# Altium schematic sheet rad_detector_v500_PERIPHERAL.SchDoc
size A4; SheetNumber: 6; SheetTotal: 7
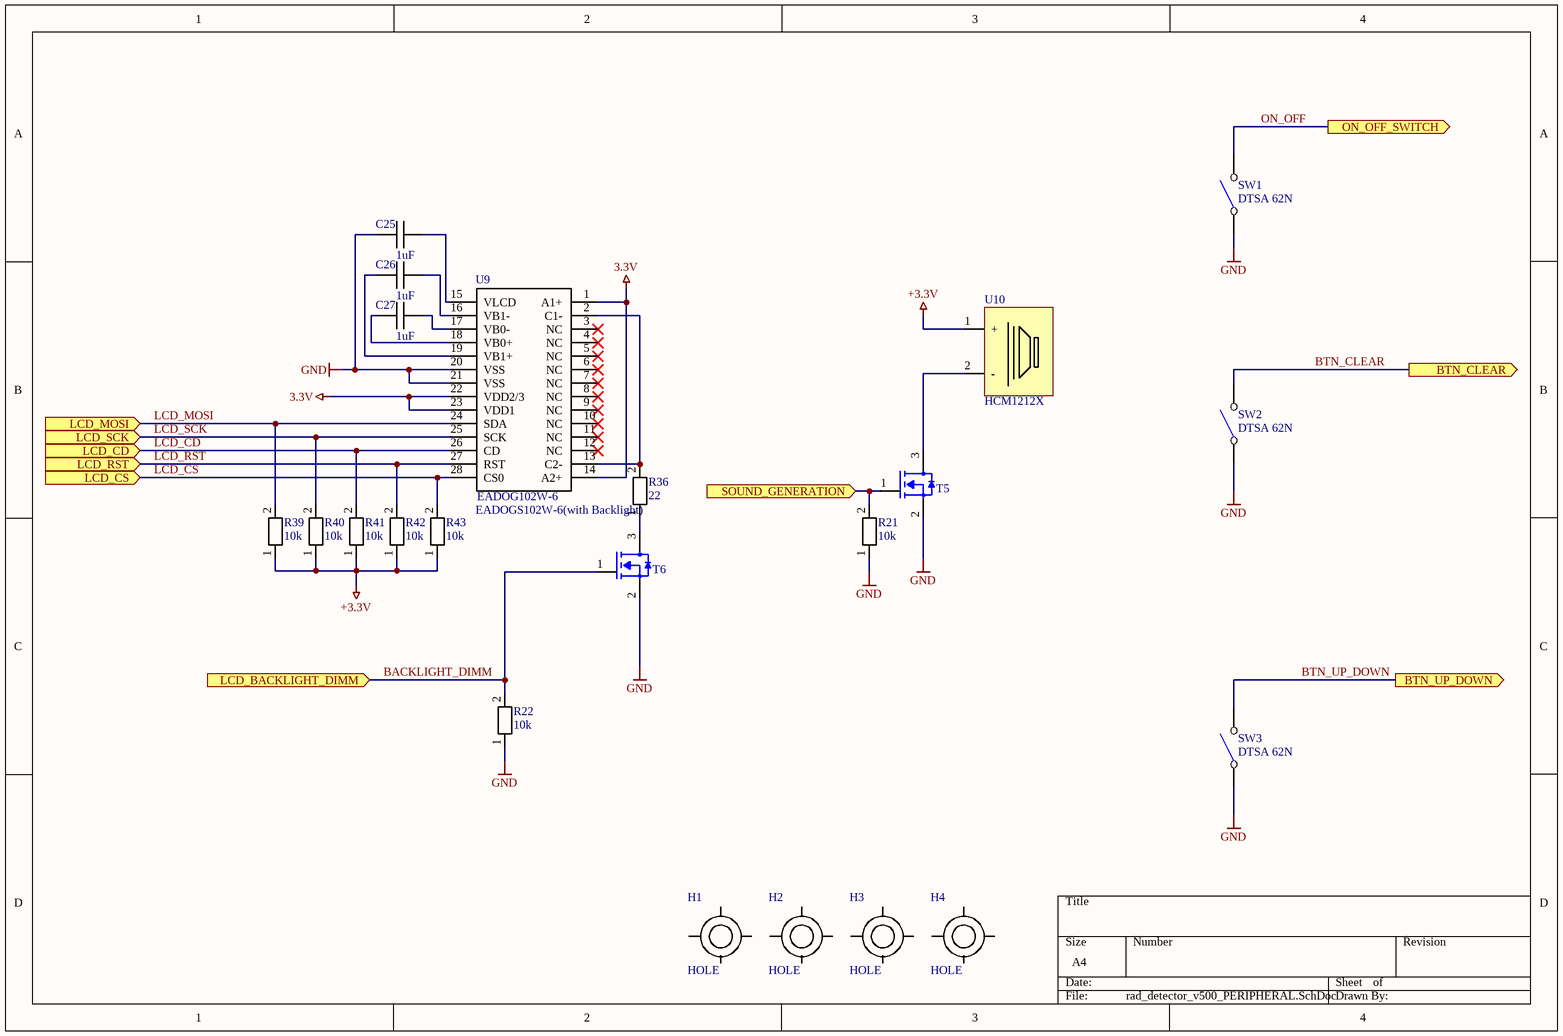
[diagram p0: rad_detector_v500_PERIPHERAL.SchDoc]

## Parts
C25  1uF  [0805_C]
C26  1uF  [0805_C]
C27  1uF  [0805_C]
H1  HOLE  [HOLE_140_160MIL]
H2  HOLE  [HOLE_140_160MIL]
H3  HOLE  [HOLE_140_160MIL]
H4  HOLE  [HOLE_140_160MIL]
R21  10k  [0805]
R22  10k  [0805]
R36  22  [1206]
R39  10k  [0805]
R40  10k  [0805]
R41  10k  [0805]
R42  10k  [0805]
R43  10k  [0805]
SW1  DTSA 62N  [SW_DTSA-62N]
SW2  DTSA 62N  [SW_DTSA-62N]
SW3  DTSA 62N  [SW_DTSA-62N]
T5  MMBF170  [SOT23]  (value not drawn)
T6  MMBF170  [SOT23]  (value not drawn)
U9  EADOGS102W-6(with Backlight)  [EADOGS102-6W]
U10  HCM1212X  [HCM1212X]

## Ports
BTN_CLEAR (out, see rad_detector_v500_MAIN[1C], rad_detector_v500_MCU[2B]), BTN_UP_DOWN (out, see rad_detector_v500_MAIN[1C], rad_detector_v500_MCU[2B]), LCD_BACKLIGHT_DIMM (in, see rad_detector_v500_MAIN[1D]), LCD_CD (in, see rad_detector_v500_MAIN[1D], rad_detector_v500_MCU[2C]), LCD_CS (in, see rad_detector_v500_MAIN[1D]), LCD_MOSI (in, see rad_detector_v500_MAIN[1D], rad_detector_v500_MCU[3C]), LCD_RST (in, see rad_detector_v500_MAIN[1D], rad_detector_v500_MCU[2C]), LCD_SCK (in, see rad_detector_v500_MAIN[1D], rad_detector_v500_MCU[3C]), ON_OFF_SWITCH (out, see rad_detector_v500_MAIN[1C]), SOUND_GENERATION (in, see rad_detector_v500_MAIN[1D])

## Nets
3.3V: U9.1(A1+) U9.14(A2+) U9.22(VDD2/3) U9.23(VDD1)
+3.3V: R39.1 R40.1 R41.1 R42.1 R43.1 U10.1(+)
GND: C25.1 R21.1 R22.1 SW1.1 SW2.1 SW3.1 T5.2(Source) T6.2(Source) U9.20(VSS) U9.21(VSS)
BACKLIGHT_DIMM: R22.2 T6.1(Gate) ; port LCD_BACKLIGHT_DIMM
BTN_CLEAR: SW2.2 ; port BTN_CLEAR
BTN_UP_DOWN: SW3.2 ; port BTN_UP_DOWN
LCD_CD: R41.2 U9.26(CD) ; port LCD_CD
LCD_CS: R43.2 U9.28(CS0) ; port LCD_CS
LCD_MOSI: R39.2 U9.24(SDA) ; port LCD_MOSI
LCD_RST: R42.2 U9.27(RST) ; port LCD_RST
LCD_SCK: R40.2 U9.25(SCK) ; port LCD_SCK
ON_OFF: SW1.2 ; port ON_OFF_SWITCH
SOUND_GENERATION: R21.2 T5.1(Gate) ; port SOUND_GENERATION
NetC25_2: C25.2 U9.15(VLCD)
NetC26_1: C26.1 U9.19(VB1+)
NetC26_2: C26.2 U9.16(VB1-)
NetC27_1: C27.1 U9.18(VB0+)
NetC27_2: C27.2 U9.17(VB0-)
NetR36_1: R36.1 T6.3(Drain)
NetR36_2: R36.2 U9.2(C1-) U9.13(C2-)
NetT5_3: T5.3(Drain) U10.2(-)

Not connected (* = marked no-connect by the designer): U9 3(NC)* 4(NC)* 5(NC)* 6(NC)* 7(NC)* 8(NC)* 9(NC)* 10(NC)* 11(NC)* 12(NC)*

## Notes on the sheet
- (in symbol EADOGS102W-6(with Backlight)) EADOG102W-6

## Library data of the parts
C25-C27 = CAPACITOR
R21 R22 R39-R43 = RESISTOR: Parameter 1: 10k
R36 = RESISTOR: Parameter 1: 10k
SW1-SW3 = SW_DTSA 62N
T5 T6 = MMBF170: N MOSFET